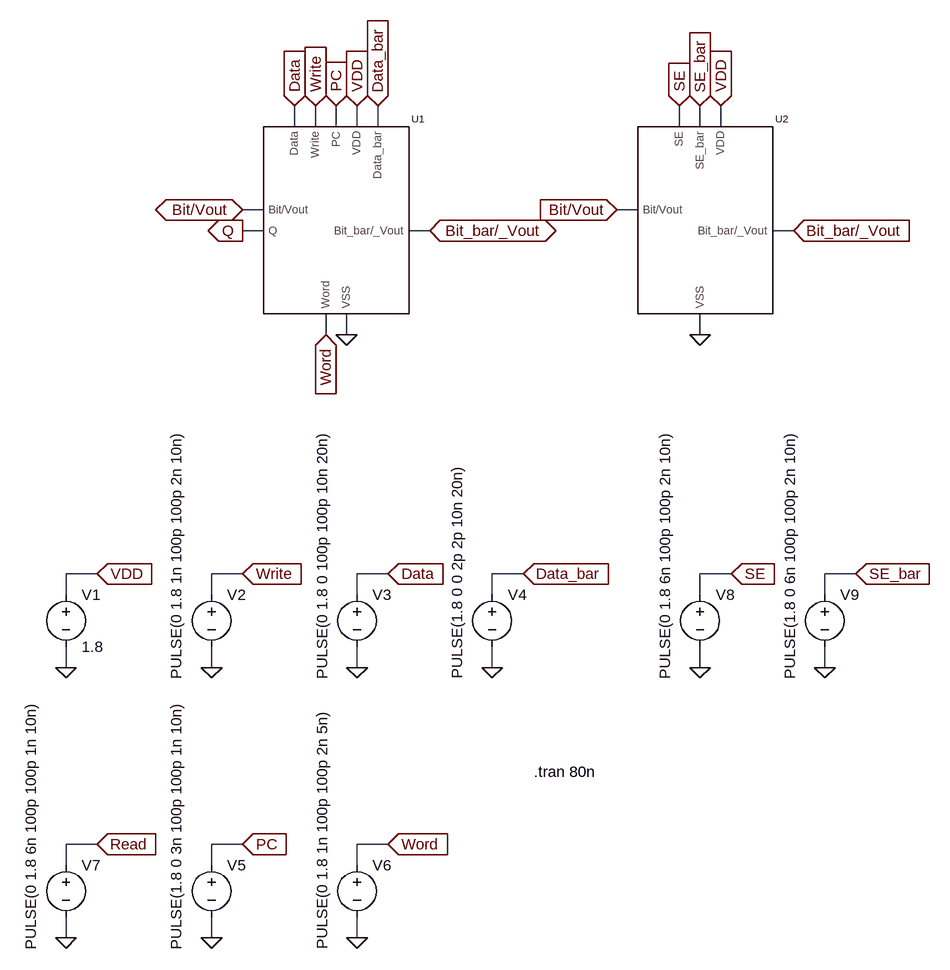
[diagram p0: schematic 1-bit_6T_SRAM_Cell_and_SA_Blocks_Test.asc]
1-bit_6T_SRAM_Cell_and_SA_Blocks_Test.asc, the LTspice schematic file:
Version 4.1
SHEET 1 1164 1284
WIRE 160 16 160 -16
WIRE 192 16 192 -16
WIRE 224 16 224 -16
WIRE 256 16 256 -16
WIRE 288 16 288 -16
WIRE 752 16 752 -16
WIRE 784 16 784 -16
WIRE 816 16 816 -16
WIRE 112 144 80 144
WIRE 688 144 656 144
WIRE 112 176 80 176
WIRE 368 176 336 176
WIRE 928 176 896 176
WIRE 208 336 208 304
WIRE 240 336 240 304
WIRE 784 336 784 304
WIRE -144 704 -192 704
WIRE 80 704 32 704
WIRE 304 704 256 704
WIRE 512 704 464 704
WIRE 832 704 784 704
WIRE 1024 704 976 704
WIRE -192 736 -192 704
WIRE 32 736 32 704
WIRE 256 736 256 704
WIRE 464 736 464 704
WIRE 784 736 784 704
WIRE 976 736 976 704
WIRE -192 848 -192 816
WIRE 32 848 32 816
WIRE 256 848 256 816
WIRE 464 848 464 816
WIRE 784 848 784 816
WIRE 976 848 976 816
WIRE -144 1120 -192 1120
WIRE 80 1120 32 1120
WIRE 304 1120 256 1120
WIRE -192 1152 -192 1120
WIRE 32 1152 32 1120
WIRE 256 1152 256 1120
WIRE -192 1264 -192 1232
WIRE 32 1264 32 1232
WIRE 256 1264 256 1232
FLAG 160 -16 Data
IOPIN 160 -16 In
FLAG 192 -16 Write
IOPIN 192 -16 In
FLAG 224 -16 PC
IOPIN 224 -16 In
FLAG 256 -16 VDD
IOPIN 256 -16 In
FLAG 288 -16 Data_bar
IOPIN 288 -16 In
FLAG 80 176 Q
IOPIN 80 176 Out
FLAG 208 336 Word
IOPIN 208 336 In
FLAG 240 336 0
FLAG 656 144 Bit/Vout
IOPIN 656 144 In
FLAG 752 -16 SE
IOPIN 752 -16 In
FLAG 784 -16 SE_bar
IOPIN 784 -16 In
FLAG 816 -16 VDD
IOPIN 816 -16 In
FLAG 784 336 0
FLAG 928 176 Bit_bar/_Vout
IOPIN 928 176 In
FLAG -192 848 0
FLAG -144 704 VDD
IOPIN -144 704 In
FLAG 32 848 0
FLAG 80 704 Write
IOPIN 80 704 In
FLAG 256 848 0
FLAG 304 704 Data
IOPIN 304 704 In
FLAG 464 848 0
FLAG 512 704 Data_bar
IOPIN 512 704 In
FLAG 32 1264 0
FLAG 80 1120 PC
IOPIN 80 1120 In
FLAG 256 1264 0
FLAG 304 1120 Word
IOPIN 304 1120 In
FLAG -192 1264 0
FLAG -144 1120 Read
IOPIN -144 1120 In
FLAG 784 848 0
FLAG 832 704 SE
IOPIN 832 704 In
FLAG 976 848 0
FLAG 1024 704 SE_bar
IOPIN 1024 704 In
FLAG 80 144 Bit/Vout
IOPIN 80 144 BiDir
FLAG 368 176 Bit_bar/_Vout
IOPIN 368 176 BiDir
SYMBOL 1-bit_6T_SRAM_Cell_200207032_Nida_Mert\\1-bit_6T_SRAM_Cell 224 160 R0
SYMATTR InstName U1
SYMBOL voltage -192 720 R0
WINDOW 123 0 0 Left 0
WINDOW 39 0 0 Left 0
SYMATTR InstName V1
SYMATTR Value 1.8
SYMBOL voltage 32 720 R0
WINDOW 3 -54 146 VLeft 2
WINDOW 123 0 0 Left 0
WINDOW 39 0 0 Left 0
SYMATTR Value PULSE(0 1.8 1n 100p 100p 2n 10n)
SYMATTR InstName V2
SYMBOL voltage 256 720 R0
WINDOW 3 -54 146 VLeft 2
WINDOW 123 0 0 Left 0
WINDOW 39 0 0 Left 0
SYMATTR Value PULSE(0 1.8 0 100p 100p 10n 20n)
SYMATTR InstName V3
SYMBOL voltage 464 720 R0
WINDOW 3 -54 146 VLeft 2
WINDOW 123 0 0 Left 0
WINDOW 39 0 0 Left 0
SYMATTR Value PULSE(1.8 0 0 2p 2p 10n 20n)
SYMATTR InstName V4
SYMBOL voltage 32 1136 R0
WINDOW 3 -54 146 VLeft 2
WINDOW 123 0 0 Left 0
WINDOW 39 0 0 Left 0
SYMATTR Value PULSE(1.8 0 3n 100p 100p 1n 10n)
SYMATTR InstName V5
SYMBOL voltage 256 1136 R0
WINDOW 3 -54 146 VLeft 2
WINDOW 123 0 0 Left 0
WINDOW 39 0 0 Left 0
SYMATTR Value PULSE(0 1.8 1n 100p 100p 2n 5n)
SYMATTR InstName V6
SYMBOL voltage -192 1136 R0
WINDOW 3 -54 146 VLeft 2
WINDOW 123 0 0 Left 0
WINDOW 39 0 0 Left 0
SYMATTR Value PULSE(0 1.8 6n 100p 100p 1n 10n)
SYMATTR InstName V7
SYMBOL voltage 784 720 R0
WINDOW 3 -54 146 VLeft 2
WINDOW 123 0 0 Left 0
WINDOW 39 0 0 Left 0
SYMATTR Value PULSE(0 1.8 6n 100p 100p 2n 10n)
SYMATTR InstName V8
SYMBOL voltage 976 720 R0
WINDOW 3 -54 146 VLeft 2
WINDOW 123 0 0 Left 0
WINDOW 39 0 0 Left 0
SYMATTR Value PULSE(1.8 0 6n 100p 100p 2n 10n)
SYMATTR InstName V9
SYMBOL Sense_Amplifier_200207032_Nida_Mert\\Sense_Amplifier 768 64 R0
SYMATTR InstName U2
TEXT 528 1008 Left 2 !.tran 80n

The netlist it stands for:
* 1-bit_6T_SRAM_Cell_and_SA_Blocks_Test.asc
X§U1 Data Write PC VDD Data_bar Word 0 Bit/Vout Q Bit_bar/_Vout 1-bit_6T_SRAM_Cell  ; pins Data Write PC VDD Data_bar Word VSS Bit/Vout Q Bit_bar/_Vout
V1 VDD 0 1.8
V2 Write 0 PULSE(0 1.8 1n 100p 100p 2n 10n)
V3 Data 0 PULSE(0 1.8 0 100p 100p 10n 20n)
V4 Data_bar 0 PULSE(1.8 0 0 2p 2p 10n 20n)
V5 PC 0 PULSE(1.8 0 3n 100p 100p 1n 10n)
V6 Word 0 PULSE(0 1.8 1n 100p 100p 2n 5n)
V7 Read 0 PULSE(0 1.8 6n 100p 100p 1n 10n)
V8 SE 0 PULSE(0 1.8 6n 100p 100p 2n 10n)
V9 SE_bar 0 PULSE(1.8 0 6n 100p 100p 2n 10n)
X§U2 SE SE_bar VDD Bit/Vout Bit_bar/_Vout 0 Sense_Amplifier  ; pins SE SE_bar VDD Bit/Vout Bit_bar/_Vout VSS
.tran 80n
.lib 1-bit_6T_SRAM_Cell.sub
.lib Sense_Amplifier.sub
.backanno
.end